# EAGLE design DummyLoad (EAGLE 7.7.0)
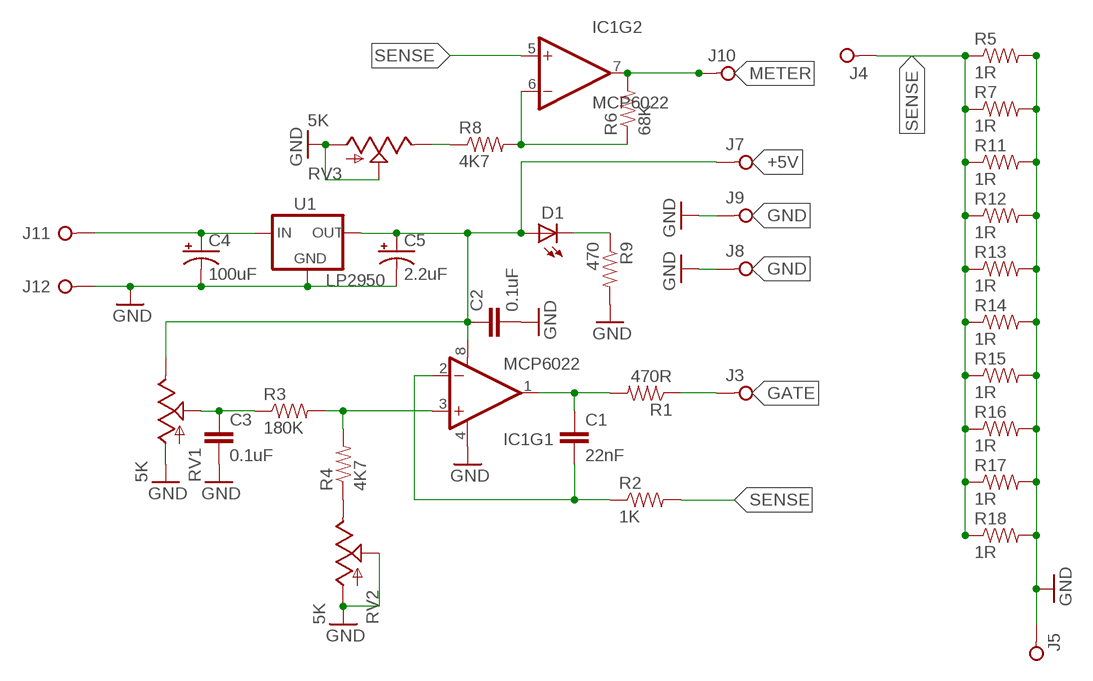
[diagram p0: schematic, sheet 1]

## Parts
C1  22nF  CAPACITOR-5MM  [CAPACITOR-5MM]
C2  0.1uF  CAPACITOR-5MM  [CAPACITOR-5MM]
C3  0.1uF  CAPACITOR-5MM  [CAPACITOR-5MM]
C4  100uF  CAP-POL-2.5-6  [CAP-POL-2.5-6]
C5  2.2uF  CAP-POL-2.5-5  [CAP-POL-2.5-5]
D1  LED-5MM  [LED5MM]
IC1  MCP6022  [DIP08]
J1  PINHD-1X2  [1X02]
J3  PINHD-1X1  [1X01]
J4  PINHD-1X1  [1X01]
J5  PINHD-1X1  [1X01]
J7  PINHD-1X1  [1X01]
J8  PINHD-1X1  [1X01]
J9  PINHD-1X1  [1X01]
J10  PINHD-1X1  [1X01]
R1  470R  RESISTOR-7.5MM  [AXIAL-7.5MM]
R2  1K  RESISTOR-7.5MM  [AXIAL-7.5MM]
R3  180K  RESISTOR-7.5MM  [AXIAL-7.5MM]
R4  4K7  RESISTOR-7.5MM  [AXIAL-7.5MM]
R5  1R  RESISTOR-7.5MM  [AXIAL-7.5MM]
R6  68K  RESISTOR-7.5MM  [AXIAL-7.5MM]
R7  1R  RESISTOR-7.5MM  [AXIAL-7.5MM]
R8  4K7  RESISTOR-7.5MM  [AXIAL-7.5MM]
R9  470  RESISTOR-7.5MM  [AXIAL-7.5MM]
R11  1R  RESISTOR-7.5MM  [AXIAL-7.5MM]
R12  1R  RESISTOR-7.5MM  [AXIAL-7.5MM]
R13  1R  RESISTOR-7.5MM  [AXIAL-7.5MM]
R14  1R  RESISTOR-7.5MM  [AXIAL-7.5MM]
R15  1R  RESISTOR-7.5MM  [AXIAL-7.5MM]
R16  1R  RESISTOR-7.5MM  [AXIAL-7.5MM]
R17  1R  RESISTOR-7.5MM  [AXIAL-7.5MM]
R18  1R  RESISTOR-7.5MM  [AXIAL-7.5MM]
RV1  5K  POT-OFFBRD  [1X03]
RV2  5K  POTTRIM  [TRIM_POT]
RV3  5K  POTTRIM  [TRIM_POT]
U1  LP2950  [TO92-INLINE]

## Nets
+5V: C2.1 C5.+ D1.A IC1.8(V+) J7.1(KL) RV1.3(E) U1.1(OUT)
GATE: J3.1(KL) R1.P$1
GND: C2.2 C3.2 C4.- C5.- IC1.4(V-) J1.2 J5.1(KL) J8.1(KL) J9.1(KL) R5.P$2 R7.P$2 R9.P$2 R11.P$2 R12.P$2 R13.P$2 R14.P$2 R15.P$2 R16.P$2 R17.P$2 R18.P$2 RV1.1(A) RV2.1(S) RV2.3(A) RV3.1(S) RV3.3(A) U1.2(GND)
METER: IC1.7(OUT) J10.1(KL) R6.P$2
N$2: C1.1 IC1.1(OUT) R1.P$2
N$3: C4.+ J1.1 U1.3(IN)
N$4: D1.K(C) R9.P$1
N$5: C1.2 IC1.2(-IN) R2.P$1
N$6: C3.1 R3.P$1 RV1.2(S)
N$8: IC1.6(-IN) R6.P$1 R8.P$2
N$11: R4.P$1 RV2.2(E)
N$12: R8.P$1 RV3.2(E)
N$13: IC1.3(+IN) R3.P$2 R4.P$2
SENSE: IC1.5(+IN) J4.1(KL) R2.P$2 R5.P$1 R7.P$1 R11.P$1 R12.P$1 R13.P$1 R14.P$1 R15.P$1 R16.P$1 R17.P$1 R18.P$1

## Library data of the parts
C1-C3 = SaintGimp:CAPACITOR-*: Ceramic Capacitor
C4 C5 = SaintGimp:CAP-POL-*: Polarized Capacitor
D1 = SaintGimp:LED-*
IC1 = SaintGimp:MCP6022: Dual opamp
J1 = SaintGimp:PINHD-1X2
J3-J5 J7-J10 = SaintGimp:PINHD-1X1
R1-R9 R11-R18 = SaintGimp:RESISTOR-*
RV1-RV3 = SaintGimp:POT
U1 = SaintGimp:LP2950: Volate Regulator

## Board
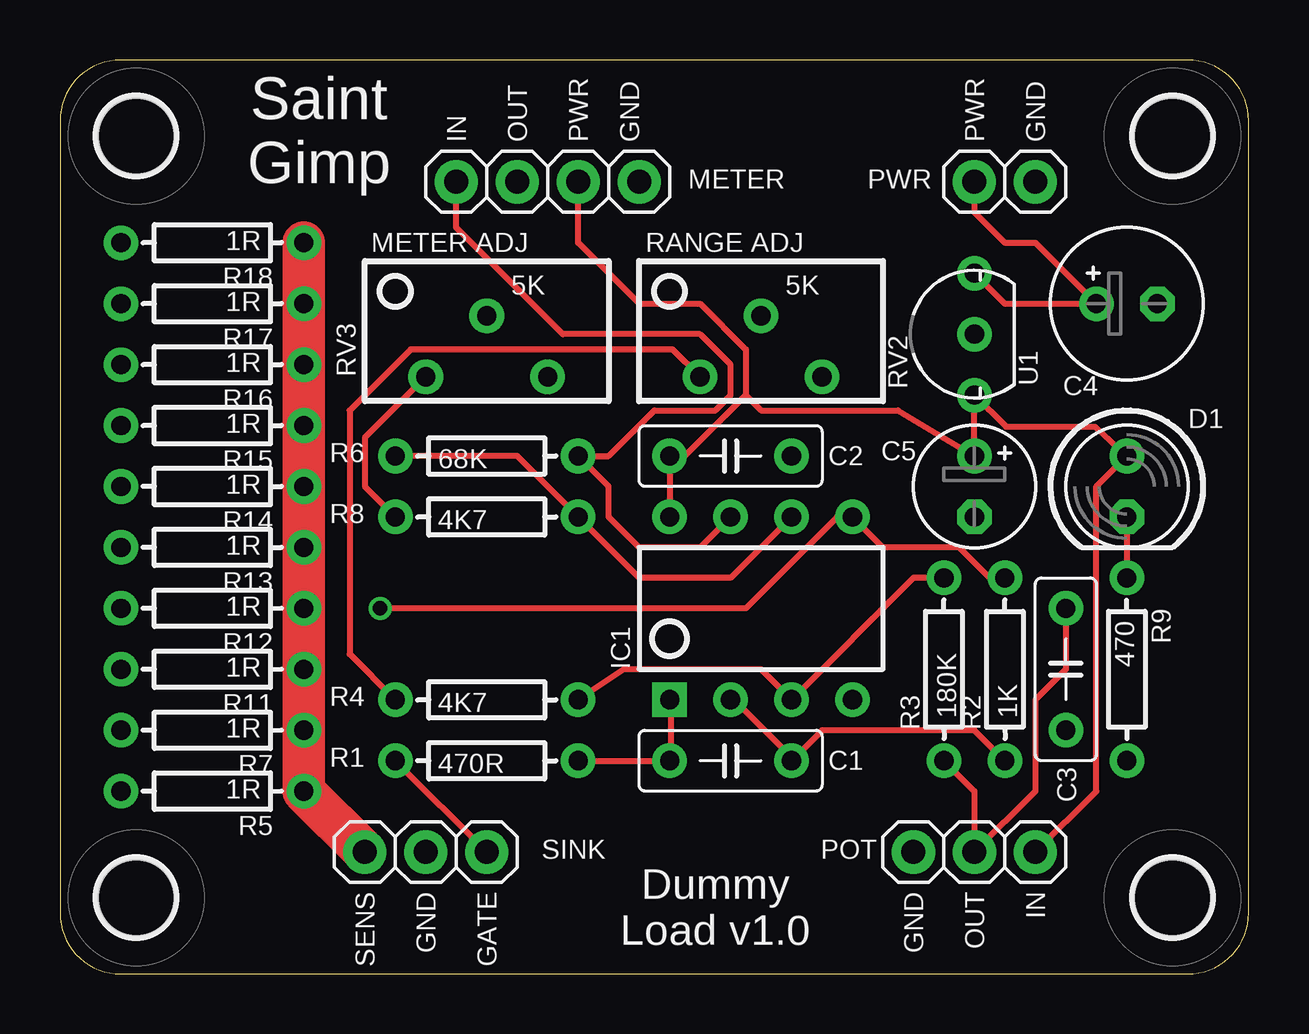
[diagram p1: board, top side]
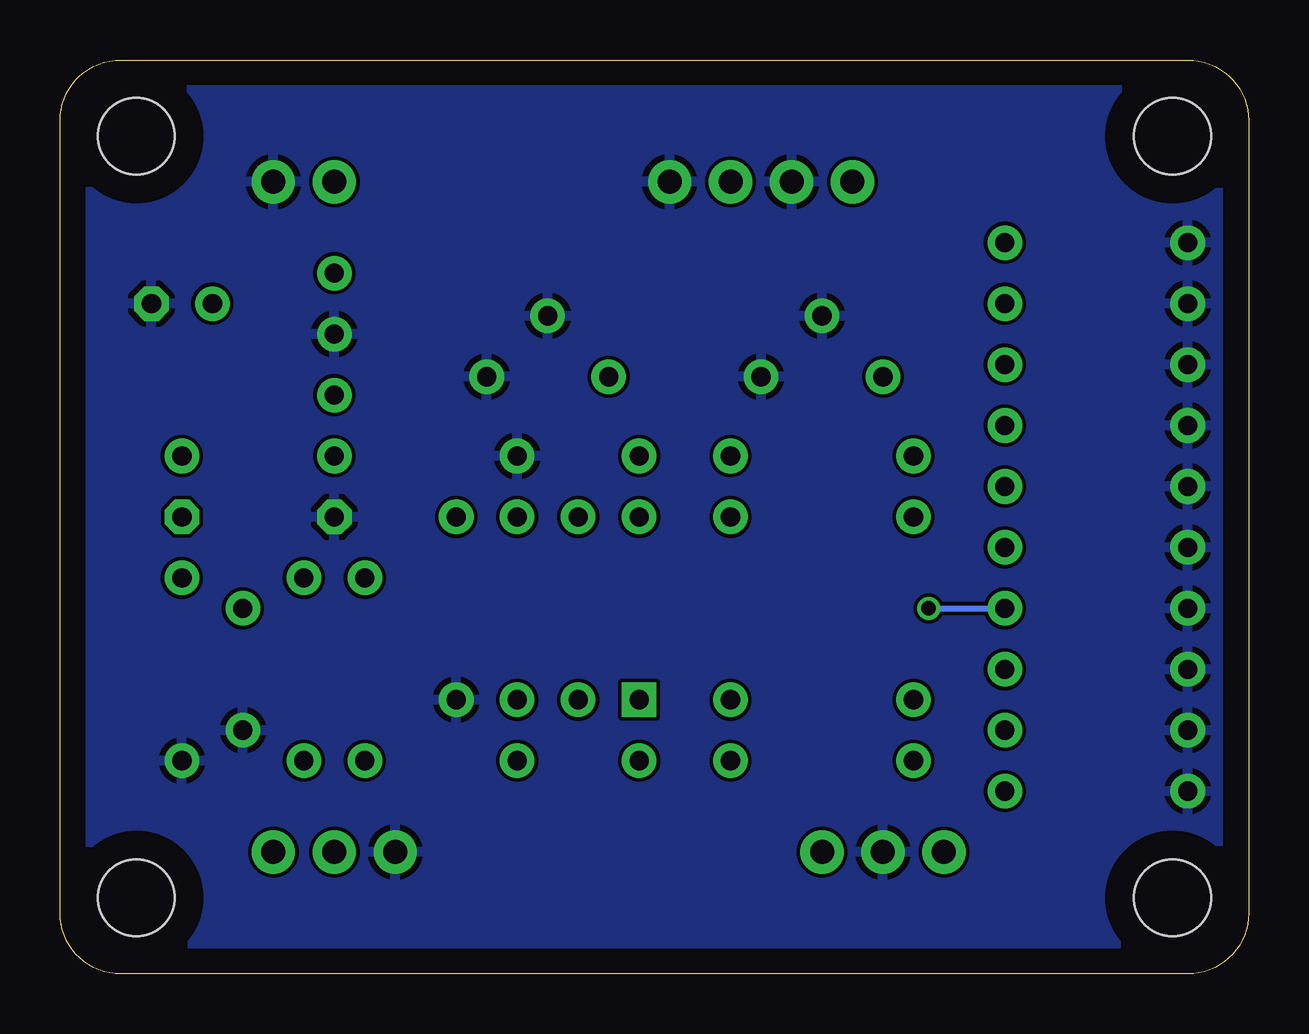
[diagram p2: board, bottom side, seen from below]

Size 49.53 x 38.1 mm. Coordinates in mm from the lower left corner, seen from the top.
Outline: 0,35.56 0,2.54 arc90 2.54,0 46.99,0 arc90 49.53,2.54 49.53,35.56 arc90 46.99,38.1 2.54,38.1 arc90 0,35.56
Copper layers (1*16): Top 0.0356mm / dielectric 1.5011mm / Bottom 0.0356mm
Design rules "Saintgimp-OSHPark": minimum track width 10mil, minimum drill 13mil, track to track 6mil, track to pad 6mil, pad to pad 6mil, via to via 6mil, smd to smd 6mil, copper to edge 15mil, drill to drill 6mil, minimum pad ring 12mil, minimum via ring 7mil, stop-mask expansion 2mil, vias tented up to drill 24mil, thermal gap 10mil

### Footprints (pad centres in the part's own frame; a part is rotated, then mirrored left to right if it is on the bottom)
CAPACITOR-5MM = drill 0.8: 1 -2.54,0; 2 2.54,0
CAP-POL-2.5-6 = drill 0.8: + -1.27,0 | drill 0.8 octagon: - 1.27,0
CAP-POL-2.5-5 = drill 0.8: + -1.27,0 | drill 0.8 octagon: - 1.27,0
LED5MM = drill 0.8: A -1.27,0 | drill 0.8 octagon: K 1.27,0
DIP08 = drill 0.8 square: 1 -3.81,-3.81 | drill 0.8: 2 -1.27,-3.81; 3 1.27,-3.81; 4 3.81,-3.81; 5 3.81,3.81; 6 1.27,3.81; 7 -1.27,3.81; 8 -3.81,3.81
1X02 = drill 1: 1 -1.27,0; 2 1.27,0
1X01 = drill 1: 1 0,0
AXIAL-7.5MM = drill 0.8: P$1 -3.81,0; P$2 3.81,0
1X03 = drill 1: 1 -2.54,0; 2 0,0; 3 2.54,0
TRIM_POT = drill 0.8: 1 0,0.762; 2 -2.54,-1.778; 3 2.54,-1.778
TO92-INLINE = drill 0.8: 1 -2.54,0; 2 0,0; 3 2.54,0
MOUNTING-HOLE-3.2MM = hole 3.2: 0,0

### Placement (x,y rotation side)
C1  27.94,8.89 0 top
C2  27.94,21.59 0 top
C3  41.91,12.7 270 top
C4  44.45,27.94 0 top
C5  38.1,20.32 270 top
D1  44.45,20.32 270 top
IC1  29.21,15.24 0 top
J1  39.37,33.02 0 top
J3  17.78,5.08 0 top
J4  12.7,5.08 180 top
J5  15.24,5.08 0 top
J7  21.59,33.02 0 top
J8  24.13,33.02 0 top
J9  19.05,33.02 0 top
J10  16.51,33.02 0 top
R1  17.78,8.89 0 top
R2  39.37,12.7 90 top
R3  36.83,12.7 90 top
R4  17.78,11.43 0 top
R5  6.35,7.62 180 top
R6  17.78,21.59 0 top
R7  6.35,10.16 180 top
R8  17.78,19.05 0 top
R9  44.45,12.7 270 top
R11  6.35,12.7 180 top
R12  6.35,15.24 180 top
R13  6.35,17.78 180 top
R14  6.35,20.32 180 top
R15  6.35,22.86 180 top
R16  6.35,25.4 180 top
R17  6.35,27.94 180 top
R18  6.35,30.48 180 top
RV1  38.1,5.08 0 top
RV2  29.21,26.67 0 top
RV3  17.78,26.67 0 top
U1  38.1,26.67 90 top
U$1  [MOUNTING-HOLE-3.2MM]  3.17,3.17 0 top
U$2  [MOUNTING-HOLE-3.2MM]  3.17,34.92 0 top
U$3  [MOUNTING-HOLE-3.2MM]  46.35,34.92 0 top
U$4  [MOUNTING-HOLE-3.2MM]  46.35,3.17 0 top

### Tracks (layer width: path | path; a pad name or v marks a point on that pad's centre or on a via)
+5V
  Top 0.254: IC1.8 C2.1 26.04,21.59 28.57,24.13 | J7.1 21.59,30.48 24.13,27.94 26.67,27.94 28.57,26.04 28.57,24.13 | 28.57,24.13 29.21,23.5 34.92,23.5 C5.+ U1.1 39.42,22.81 43.13,22.81 D1.A 43.18,20.32 43.18,7.62 RV1.3
GATE
  Top 0.254: R1.P$1 J3.1
GND
  pour Bottom: 1.27,36.83 48.26,36.83 48.26,1.27 1.27,1.27
METER
  Top 0.254: IC1.7 26.67,17.78 24.13,17.78 22.86,19.05 22.86,20.32 R6.P$2 22.86,21.59 24.77,23.5 27.3,23.5 27.94,24.13 27.94,25.4 26.67,26.67 20.95,26.67 16.51,31.11 J10.1
N$2
  Top 0.254: IC1.1 25.45,11.43 25.45,8.99 C1.1 R1.P$2
N$3
  Top 0.254: U1.3 39.37,27.94 C4.+ 40.64,30.48 39.37,30.48 38.1,31.75 J1.1
N$4
  Top 0.254: D1.K R9.P$1
N$5
  Top 0.254: IC1.2 28.09,11.43 30.53,8.99 C1.2 31.75,10.16 38.1,10.16 R2.P$1
N$6
  Top 0.254: C3.1 41.91,12.7 40.64,11.43 40.64,7.62 RV1.2 38.1,7.62 R3.P$1
N$8
  Top 0.254: IC1.6 27.94,16.51 24.13,16.51 R8.P$2 19.05,21.59 R6.P$1
N$11
  Top 0.254: RV2.2 25.53,26.04 14.61,26.04 12.06,23.5 12.06,13.34 R4.P$1
N$12
  Top 0.254: RV3.2 12.7,22.35 12.7,20.32 R8.P$1
N$13
  Top 0.254: R3.P$2 35.56,16.51 IC1.3 29.21,12.7 23.5,12.7 R4.P$2
  Bottom 0.254: 30.53,11.43 IC1.3
SENSE  (via drill 0.6)
  Top 0.254: 33.17,18.95 IC1.5 | IC1.5 34.29,17.78 37.47,17.78 38.73,16.51 R2.P$2 | IC1.5 32.38,19.05 28.57,15.24 v13.34,15.24
  Top 1.778: R18.P$1 R17.P$1 R16.P$1 R15.P$1 R14.P$1 R13.P$1 R12.P$1 R11.P$1 R7.P$1 R5.P$1 J4.1
  Bottom 0.254: v13.34,15.24 R12.P$1

### Text on the board
_tsilk: Saint / Gimp | IN | OUT | PWR | GND | PWR | GND | METER | PWR | METER ADJ | RANGE ADJ | SINK | POT | SENS | GND | GATE | Dummy / Load v1.0 | GND | OUT | IN